# EAGLE design kicker (EAGLE 6.1)
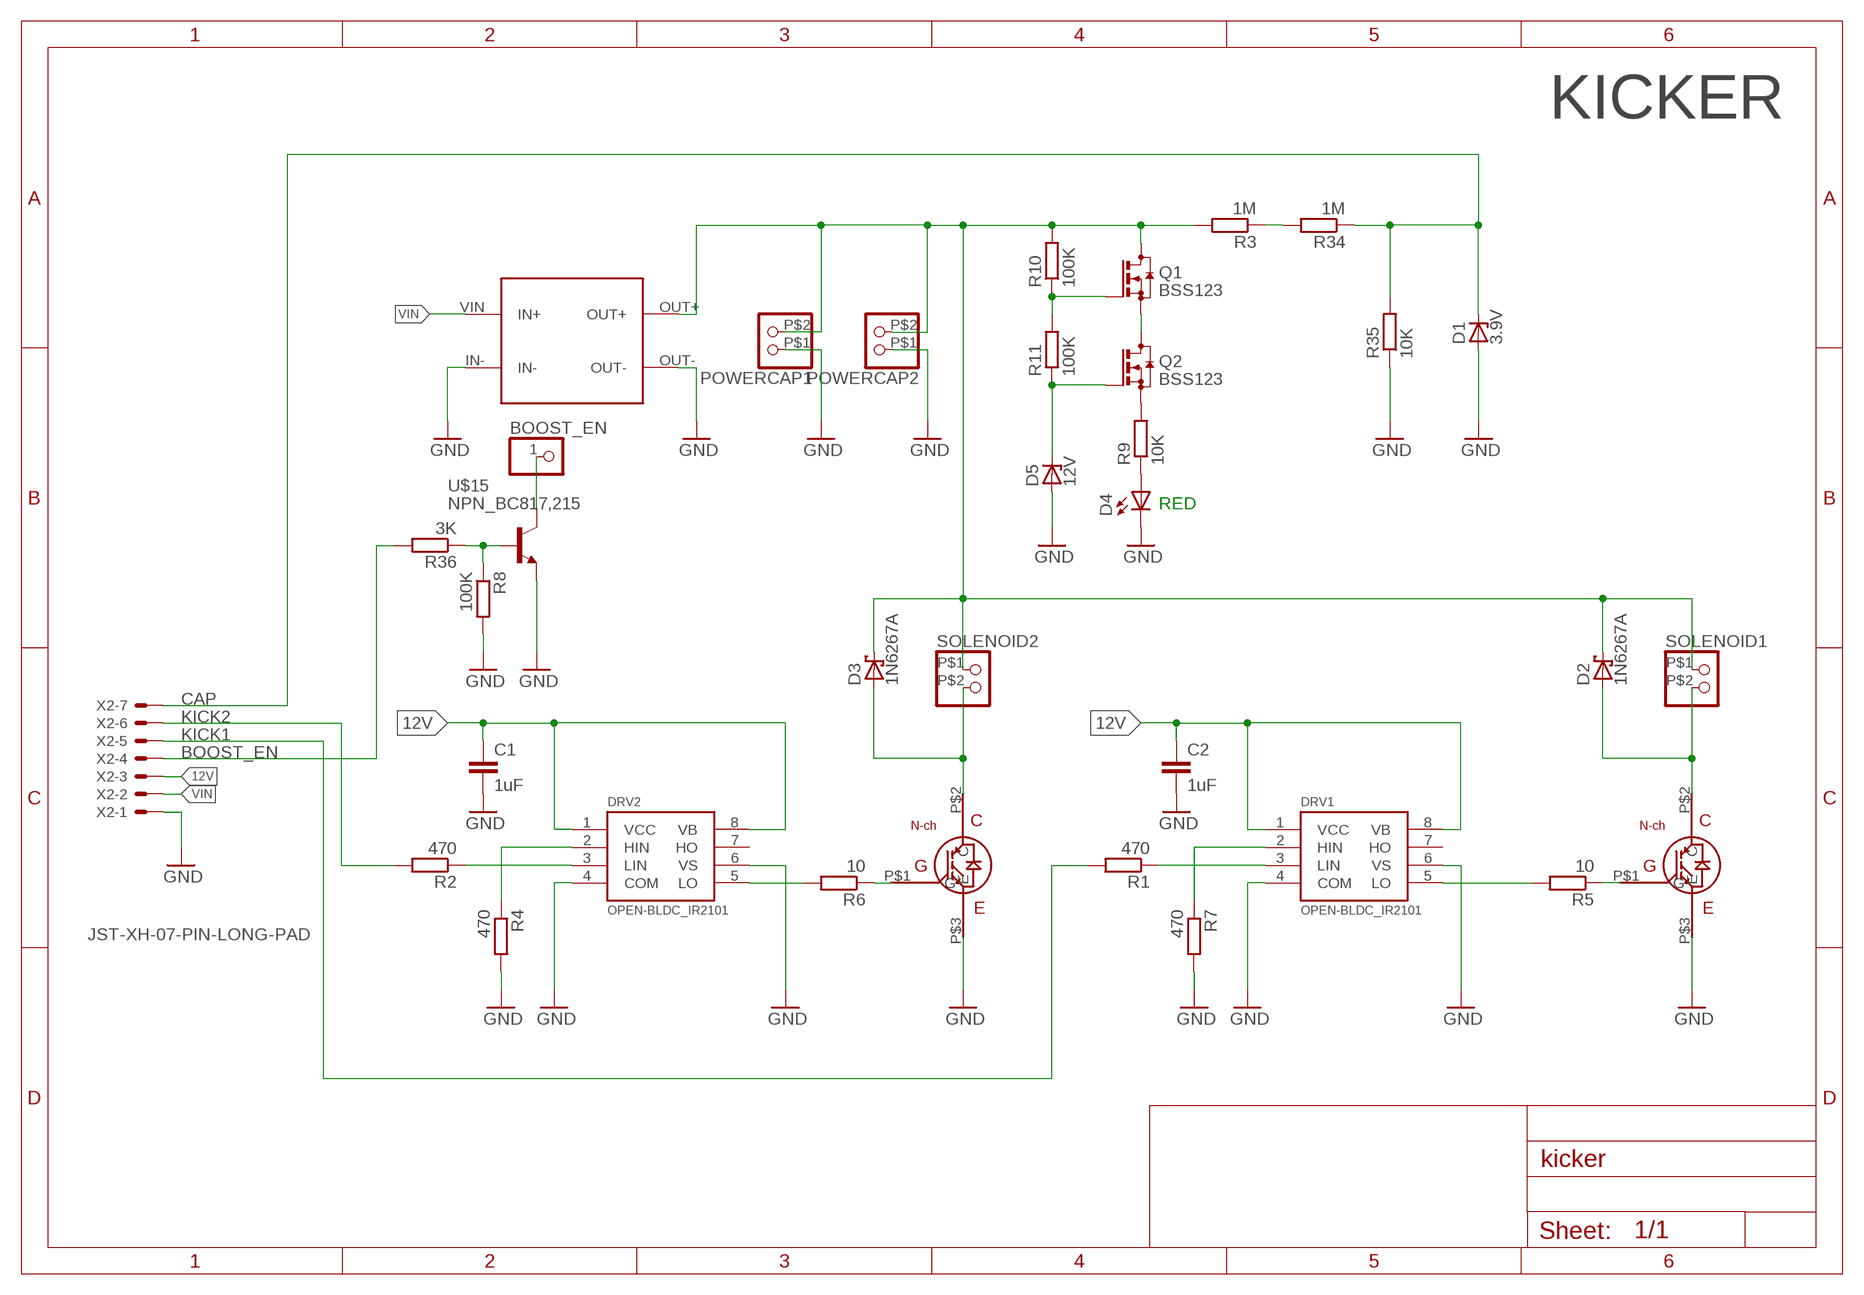
[diagram p0: schematic, sheet 1]

## Parts
BOOST_EN  CONNEC_1X01  [CONNEC_1X01]
C1  1uF  C-EUC0805  [C0805]
C2  1uF  C-EUC0805  [C0805]
D1  3.9V  ZENER-DIODESOD80C  [SOD80C]
D2  1N6267A  [C4111-15]
D3  1N6267A  [C4111-15]
D4  RED  LED1206  [LED-1206]
D5  12V  ZENER-DIODESOD80C  [SOD80C]
DRV1  OPEN-BLDC_IR2101  [OPEN-BLDC_SO-8]
DRV2  OPEN-BLDC_IR2101  [OPEN-BLDC_SO-8]
POWERCAP1  CONNEC_1X02BIG  [CONNEC_1X02_BIG]
POWERCAP2  CONNEC_1X02BIG  [CONNEC_1X02_BIG]
Q1  BSS123  [SOT23]
Q2  BSS123  [SOT23]
R1  470  RESISTANCE-R0805  [R0805]
R2  470  RESISTANCE-R0805  [R0805]
R3  1M  RESISTANCE-R0805  [R0805]
R4  470  RESISTANCE-R0805  [R0805]
R5  10  RESISTANCE-R0805  [R0805]
R6  10  RESISTANCE-R0805  [R0805]
R7  470  RESISTANCE-R0805  [R0805]
R8  100K  RESISTANCE-R0805  [R0805]
R9  10K  RESISTANCE-R0805  [R0805]
R10  100K  RESISTANCE-R0805  [R0805]
R11  100K  RESISTANCE-R0805  [R0805]
R34  1M  RESISTANCE-R0805  [R0805]
R35  10K  RESISTANCE-R0805  [R0805]
R36  3K  RESISTANCE-R0805  [R0805]
SOLENOID1  CONNEC_1X02BIG  [CONNEC_1X02_BIG]
SOLENOID2  CONNEC_1X02BIG  [CONNEC_1X02_BIG]
U$1  TO-247A  [TO-247]
U$5  BOOSTER  [BOOSTER_390V]
U$11  TO-247A  [TO-247]
U$15  NPN_BC817,215  [SOT-23]
X2  JST-XH-07-PIN-LONG-PAD  [JST-XH-07-PACKAGE-LONG-PAD]

## Nets
12V: C1.1 C2.1 DRV1.1(VCC) DRV1.8(VB) DRV2.1(VCC) DRV2.8(VB) X2.3
BOOST_EN: R36.2 X2.4
CAP: D1.C R34.1 R35.2 X2.7
GND [alim_big]: C1.2 C2.2 D1.A D4.C D5.A DRV1.4(COM) DRV1.6(VS) DRV2.4(COM) DRV2.6(VS) POWERCAP1.P$1 POWERCAP2.P$1 R4.2 R7.2 R8.2 R35.1 U$1.P$3(E) U$5.IN- U$5.OUT- U$11.P$3(E) U$15.2(E) X2.1
KICK1: R1.2 X2.5
KICK2: R2.2 X2.6
N$1: DRV2.3(LIN) R2.1
N$2 [alim_big]: D2.A SOLENOID1.P$2 U$1.P$2(C)
N$3: DRV2.5(LO) R6.2
N$4: R3.1 R34.2
N$5: DRV1.3(LIN) R1.1
N$6: DRV2.2(HIN) R4.1
N$7: R5.1 U$1.P$1(G)
N$8: R6.1 U$11.P$1(G)
N$9: DRV1.5(LO) R5.2
N$10: Q2.2(S) R9.2
N$11: D4.A R9.1
N$12: Q1.2(S) Q2.3(D)
N$13: DRV1.2(HIN) R7.1
N$14: Q1.1(G) R10.1 R11.2
N$16 [alim_big]: D5.C Q2.1(G) R11.1
N$36 [alim_big]: D3.A SOLENOID2.P$2 U$11.P$2(C)
N$37: BOOST_EN.1 U$15.3(C)
N$38: R8.1 R36.1 U$15.1(B)
VBOOST: D2.C D3.C POWERCAP1.P$2 POWERCAP2.P$2 Q1.3(D) R3.2 R10.2 SOLENOID1.P$1 SOLENOID2.P$1 U$5.OUT+
VIN [alim_big]: U$5.VIN(IN+) X2.2
Unconnected: DRV1.7(HO) DRV2.7(HO)

## Notes on the sheet
- KICKER
- RED

## Library data of the parts
BOOST_EN = rhoban:CONNEC_1X01; FARNELL: -
C1 C2 = rcl:C-EU: CAPACITOR, European symbol
D1 = diode:ZENER-DIODE: Z-Diode; FARNELL: 1097198
D2 D3 = diode:1N6267A: DIODE transient voltage suppressor; FARNELL: 9551735
D4 = SparkFun:LED: LEDs Standard schematic elements and footprints for 5mm, 3mm, 1206, and 0603 sized LEDs. 5mm - Spark Fun Electronics SKU : COM-00529 (and others); FARNELL: 1581233
D5 = diode:ZENER-DIODE: Z-Diode; FARNELL: 2319144
DRV1 DRV2 = rhoban:OPEN-BLDC_IR2101; FARNELL: 8638730
POWERCAP1 POWERCAP2 SOLENOID1 SOLENOID2 = rhoban:CONNEC_1X02; FARNELL: -
Q1 Q2 = transistor-small-signal:BSS123: N-CHANNEL MOS FET
R1 R2 R4-R8 R36 = rhoban:RESISTANCE: RESISTOR, European symbol; FARNELL: 2446965
R3 R34 = rhoban:RESISTANCE: RESISTOR, European symbol; FARNELL: 2129375
R9-R11 R35 = rhoban:RESISTANCE: RESISTOR, European symbol; FARNELL: 2447553
U$1 U$11 = to-247_n-channel_igbt:TO-247; FARNELL: 2429705
U$5 = rhoban:BOOSTER; FARNELL: -
U$15 = rhoban:NPN; FARNELL: 1081223
X2 = Rembrandt Electronics - JST XH Connectors v1-0:JST-XH-07-PIN: JST XH Connector 2 Pin Wire to board connector. Pitch: 2,54 mm, (0.100") Number of pins: 7 Created by Rembrandt Electronics www.rembrandtelectronics.com

## Net classes
0 default: width 0.381 mm
1 alim_small: width 0.381 mm
2 alim_big: width 0.381 mm

## Board
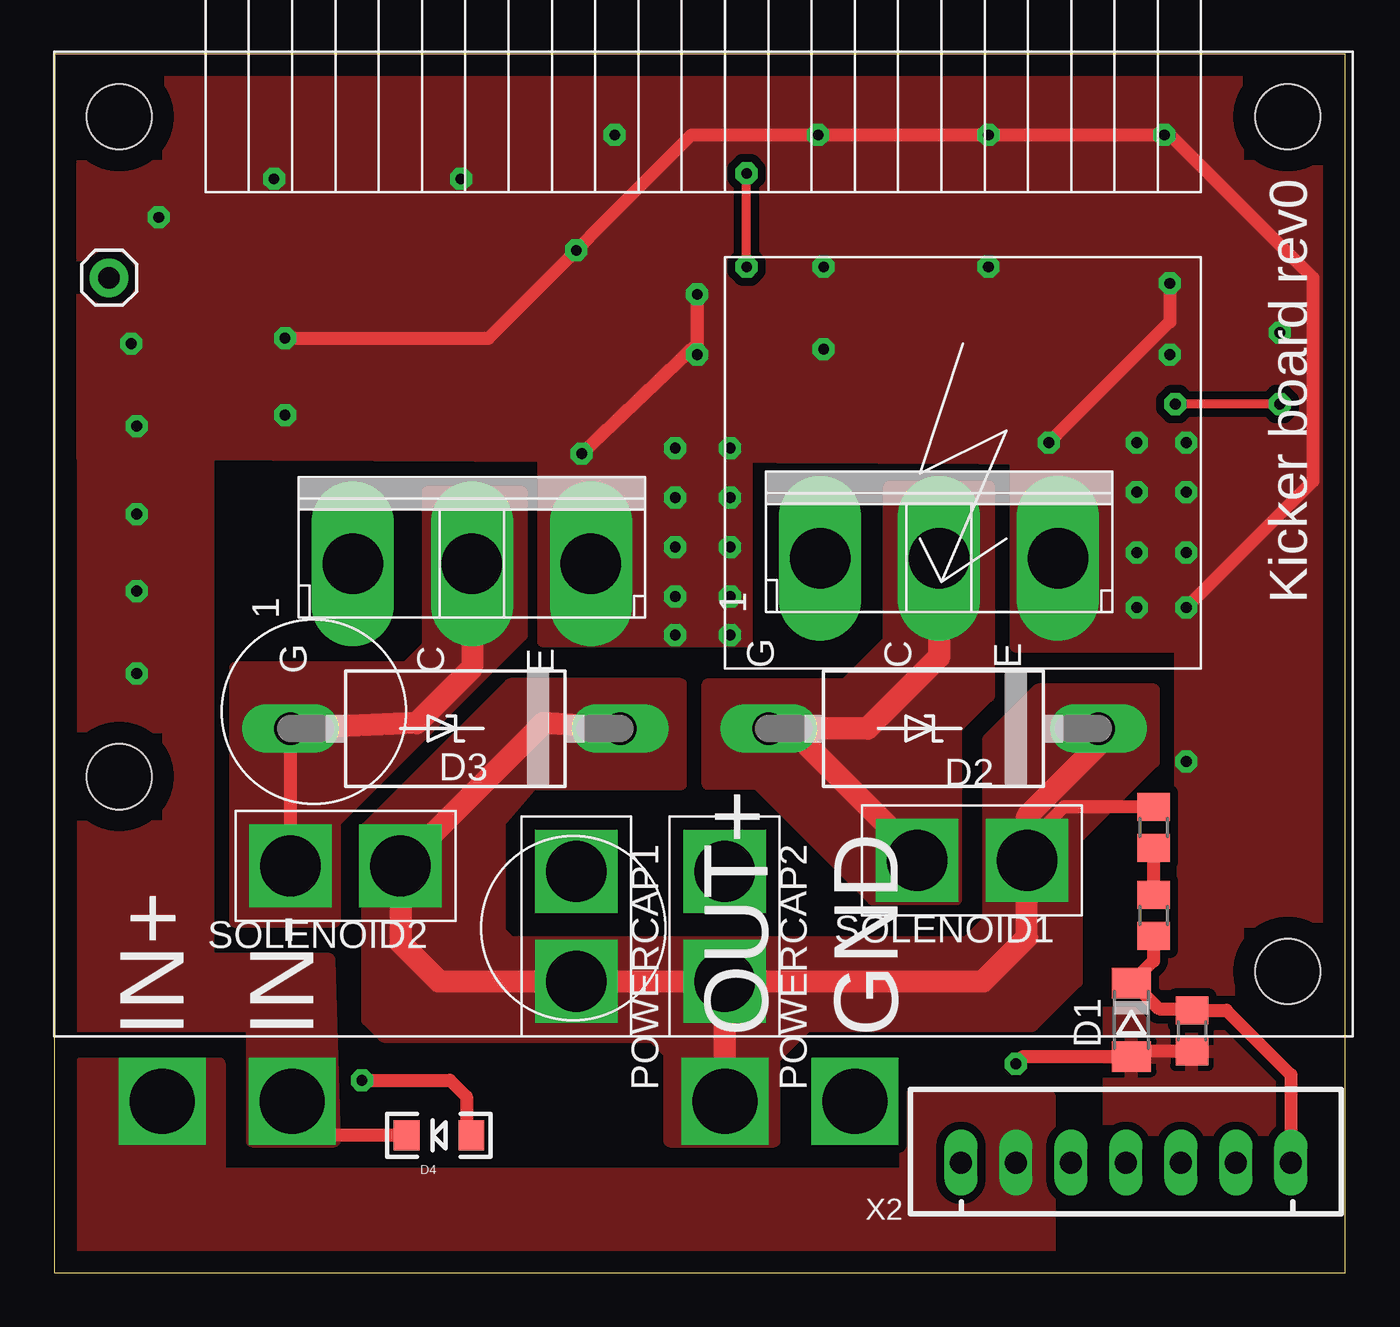
[diagram p1: board, top side]
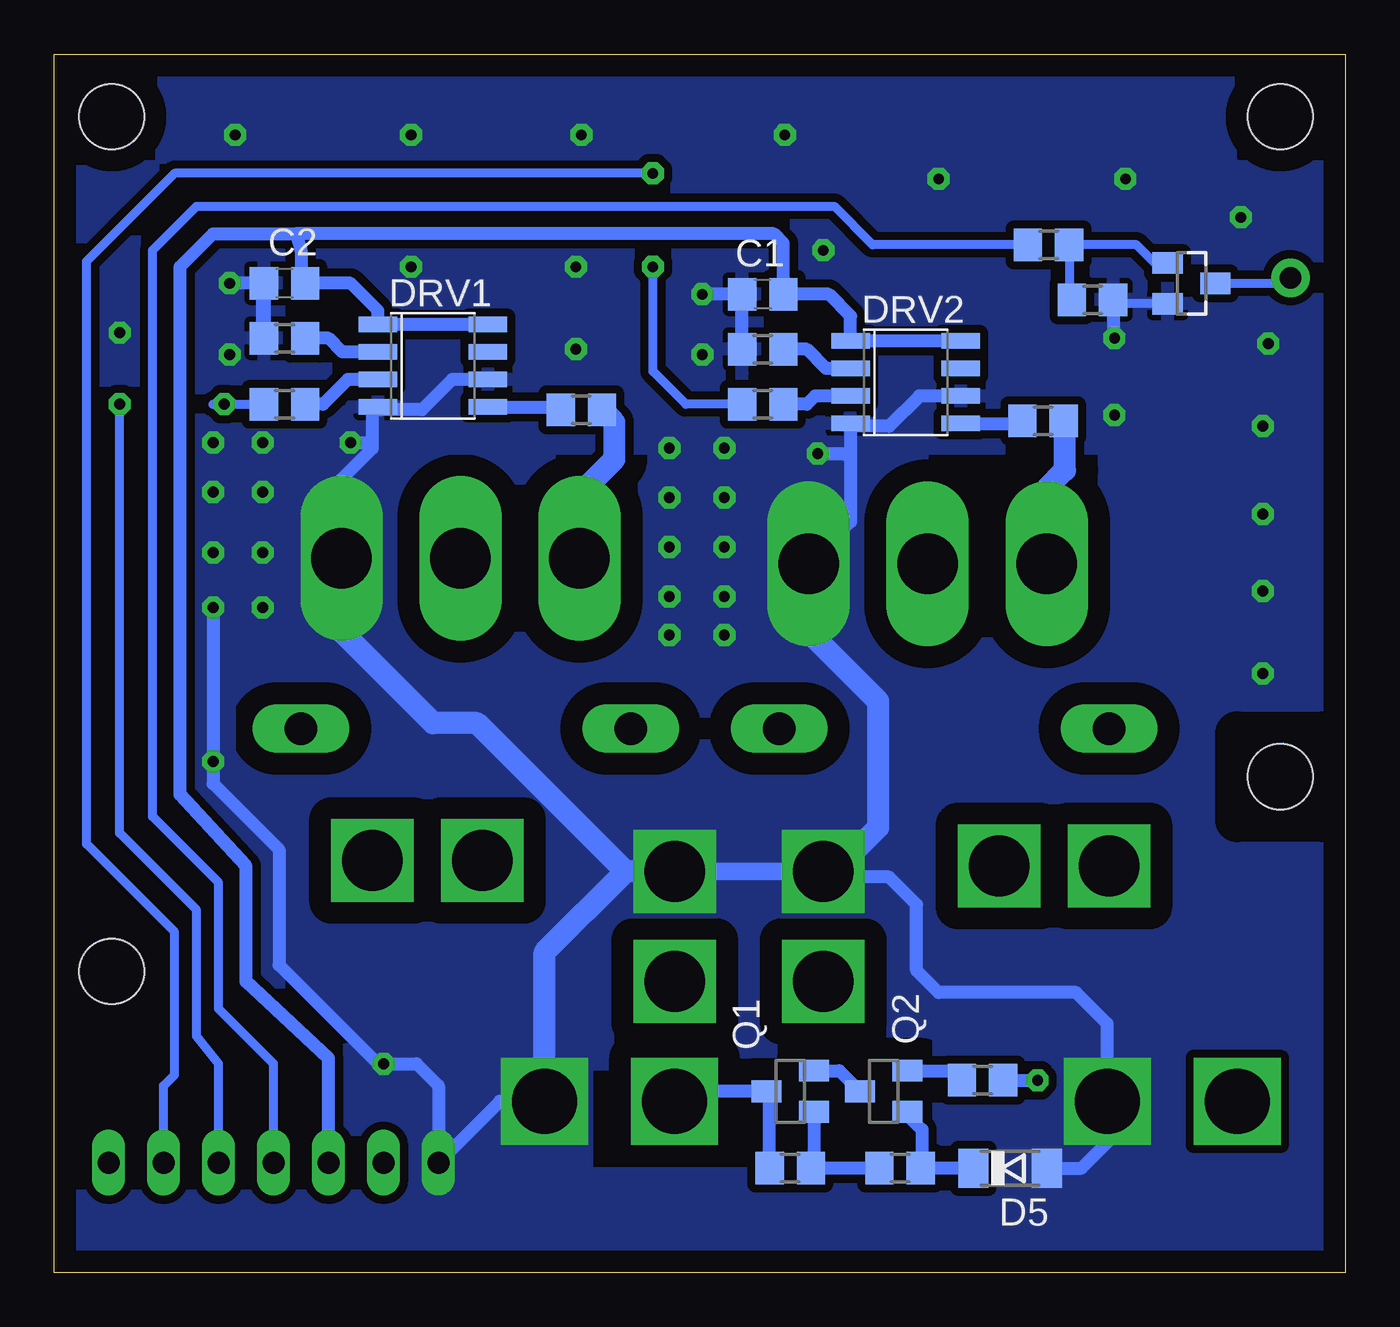
[diagram p2: board, bottom side, seen from below]

Size 59.67 x 56.31 mm. Coordinates in mm from the lower left corner, seen from the top.
Outline: 0,0 59.67,0 59.67,56.31 0,56.31 0,0
Copper layers (1*16): Top 0.035mm / dielectric 1.5mm / Bottom 0.035mm
Design rules: minimum track width 10mil, minimum drill 0.5mm, track to track 15mil, track to pad 20mil, pad to pad 8mil, via to via 8mil, smd to smd 8mil, copper to edge 40mil, drill to drill 8mil, minimum pad ring 10mil, minimum via ring 8mil, stop-mask expansion 0mil, vias tented up to drill 0mil, thermal gap 10mil

### Footprints (pad centres in the part's own frame; a part is rotated, then mirrored left to right if it is on the bottom)
CONNEC_1X01 = drill 1 pad 1.778: 1 0,0
C0805 = smd 1.3 x 1.5: 1 -0.95,0; 2 0.95,0
SOD80C = smd 1.4 x 1.8: A 1.7,0; C -1.7,0
C4111-15 = drill 1.499 long: A 7.62,0; C -7.62,0
LED-1206 = smd 1.2 x 1.4: A -1.5,0; C 1.5,0
OPEN-BLDC_SO-8 = smd 0.72 x 1.78: 1 -1.905,-2.543; 2 -0.635,-2.543; 3 0.635,-2.543; 4 1.905,-2.543; 5 1.905,2.543; 6 0.635,2.543; 7 -0.635,2.543; 8 -1.905,2.543
CONNEC_1X02_BIG = drill 2.8 square: P$1 0,0; P$2 5.08,0
SOT23 = smd 1 x 1.4: 1 -0.95,-1.1; 2 0.95,-1.1; 3 0,1.1
R0805 = smd 1.3 x 1.5: 1 -0.95,0; 2 0.95,0
TO-247 = drill 2.8 pad 3.81 long: P$1 0,5.5; P$2 0,0; P$3 0,-5.5
BOOSTER_390V = drill 3 square: IN- 11,-3; OUT+ 31,-3; OUT- 37,-3; VIN 5,-3 | hole 3: 57,3; 57,42.5; 3,42.5; 3,12
SOT-23 = smd 1 x 1.4: 1 -0.95,-1.1; 2 0.95,-1.1; 3 0,1.1
JST-XH-07-PACKAGE-LONG-PAD = drill 1.016 long: 1 -7.62,0; 2 -5.08,0; 3 -2.54,0; 4 0,0; 5 2.54,0; 6 5.08,0; 7 7.62,0

### Placement (x,y rotation side)
BOOST_EN  2.54,45.97 90 top
C1  26.92,45.21 180 bottom
C2  49.02,45.72 180 bottom
D1  49.78,11.68 270 top
D2  40.64,25.15 180 top
D3  18.54,25.15 180 top
D4  17.78,6.35 180 top
D5  15.49,4.83 0 bottom
DRV1  42.16,41.91 270 bottom
DRV2  20.32,41.15 270 bottom
POWERCAP1  24.13,18.54 270 top
POWERCAP2  30.99,18.54 270 top
Q1  25.65,8.38 90 bottom
Q2  21.34,8.38 90 bottom
R1  49.02,40.13 180 bottom
R2  26.92,40.13 180 bottom
R3  50.8,20.57 90 top
R4  26.92,42.67 180 bottom
R5  35.31,39.88 180 bottom
R6  13.97,39.37 180 bottom
R7  49.02,43.18 180 bottom
R8  11.68,44.96 0 bottom
R9  16.76,8.89 180 bottom
R10  25.65,4.83 180 bottom
R11  20.57,4.83 180 bottom
R34  50.8,16.51 90 top
R35  52.58,11.18 90 top
R36  13.72,47.5 180 bottom
SOLENOID1  44.96,19.05 180 top
SOLENOID2  16,18.8 180 top
U$1  40.89,33.02 90 top
U$5  0,10.92 0 top
U$11  19.3,32.77 90 top
U$15  7.11,45.72 270 bottom
X2  49.53,5.08 0 top

### Tracks (layer width: path | path; a pad name or v marks a point on that pad's centre or on a via)
12V
  Bottom 0.61: DRV2.8 DRV2.1 22.86,44.2 23.88,45.21 C1.1 25.97,47.56 26.42,48.01 48.51,48.01 | DRV1.8 DRV1.1 44.71,44.45 45.97,45.72 C2.1 48.26,45.91 48.26,47.24 48.51,48.01 | X2.3 46.99,9.91 50.8,13.46 50.8,18.8 53.85,22.1 53.85,46.48 52.32,48.01 48.51,48.01
BOOST_EN
  Bottom 0.406: X2.4 49.53,9.65 52.07,12.19 52.07,18.03 55.12,21.08 55.12,47.24 53.09,49.28 23.62,49.28 21.84,47.5 R36.2
CAP
  Top 0.61: R34.1 50.8,14.4 D1.C 49.86,13.38 51.05,12.19 52.51,12.19 R35.2 54.17,12.13 57.15,9.14 X2.7
GND  (via drill 0.5 pad 1.02)
  Top 0.61: v51.56,45.72 51.56,43.94 v45.97,38.35 | v29.72,45.21 29.72,42.93 v24.38,37.85 | v10.67,43.18 20.07,43.18 29.46,52.58 51.56,52.58 58.17,45.97 58.17,36.58 v52.32,30.73 | 11.46,8.38 U$5.IN- | D4.C 12.45,6.35 10.92,7.87 | R35.1 50.03,10.23 D1.A 44.78,9.98 v44.45,9.65
  Bottom 0.406: U$15.2 10.55,44.77 R8.2
  Bottom 0.61: 22.86,37.59 DRV2.4 22.74,39.12 21.08,39.12 19.68,40.51 DRV2.6 | 22.86,37.59 22.86,34.71 U$11.P$3 | U$1.P$3 46.39,36.66 44.96,38.1 44.96,38.35 | 44.96,38.35 44.96,39.75 DRV1.4 44.58,39.88 42.67,39.88 41.27,41.27 DRV1.6 | C2.2 49.97,43.5 50.29,43.18 50.04,42.93 50.04,45.47 50.29,45.72 v51.56,45.72 | v45.97,38.35 44.96,38.35 | C1.2 R4.2 27.87,45.15 27.94,45.21 v29.72,45.21 | v24.38,37.85 23.12,37.85 22.86,37.59 | R8.2 10.73,43.25 v10.67,43.18 | 24.13,18.03 23.88,18.29 21.08,18.29 19.81,17.02 19.81,13.97 18.8,12.95 12.45,12.95 11,11.51 U$5.IN- 10.92,7.84 10.92,6.1 12.19,4.83 D5.A | U$5.OUT- 39.07,7.92 X2.1 41.91,8.64 42.93,9.65 v44.45,9.65 44.45,9.4 49.28,14.22 49.28,19.56 52.32,22.61 v52.32,30.73
  Bottom 0.813: POWERCAP1.P$1 POWERCAP2.P$1 31.5,19.05
  Bottom 1.016: U$11.P$3 24.8,29.63 21.59,26.42 21.59,20.57 24.13,18.03 24.13,18.29 23.88,18.54 | POWERCAP2.P$1 33.27,18.54 | 33.27,18.54 40.13,25.4 42.16,25.4 46.48,29.72 46.48,32.93 U$1.P$3 | U$5.OUT- 37,14.82 33.27,18.54
  other vias: 10.67,39.62 3.81,27.69 3.81,31.5 3.81,35.05 3.81,39.12 3.56,42.93 28.7,35.81 28.7,33.53 28.7,31.24 28.7,29.46 31.24,29.46 31.24,31.24 31.24,33.53 31.24,35.81 50.04,30.73 50.04,33.27 50.04,36.07 52.32,36.07 52.32,33.27 52.32,38.35 50.04,38.35 28.7,38.1 31.24,38.1 35.56,42.67 35.56,46.48 43.18,46.48 35.31,52.58 43.18,52.58 51.31,52.58 4.83,48.77 10.16,50.55 18.8,50.55 25.91,52.58 24.13,47.24 29.72,42.42 51.56,42.42 56.64,43.43 52.32,23.62
  pour Bottom (no thermals): 0.25,14.73 18.8,14.73 18.8,4.57 35.05,4.57 35.05,10.41 59.69,10.16 59.69,0 59.44,0.25 0,0.25 0.25,0.51
  pour Bottom (isolate 1.016, no thermals): 1.02,38.35 51.56,38.35 51.82,9.65 1.27,9.65
  pour Bottom: 0.25,56.39 59.18,56.39 59.18,2.03 49.28,2.03 49.28,22.35 51.56,22.35 51.56,38.1 0.25,38.1
  pour Top: 0.76,55.63 59.18,55.63 59.18,0.76 48.77,0.76 48.77,18.54 52.07,21.59 52.07,37.59 0.76,37.85
  pour Top (no thermals): 12.95,6.1 12.7,14.48 7.11,14.48 7.11,38.1 1.02,38.1 1.02,11.43 9.14,11.43 9.14,6.1
  pour Top (no thermals): 22.61,37.59 22.61,29.21 32,29.21 32,37.85 22.86,37.85
  pour Top (no thermals): 44.45,37.34 44.45,28.96 53.85,28.96 53.85,37.59 44.7,37.59
KICK1  (via drill 0.5 pad 1.02)
  Top 0.406: v56.64,40.13 v51.82,40.13
  Bottom 0.406: X2.5 52.07,9.65 53.09,10.92 53.09,16.76 56.64,20.32 v56.64,40.13 | 52.32,40.13 v51.82,40.13 50.04,40.13 | 50.04,40.13 49.78,40.39 | R1.2 50.04,40.13
KICK2  (via drill 0.5 pad 1.02)
  Top 0.406: v32,46.48 v32,50.8
  Bottom 0.406: X2.6 54.61,8.64 54.1,9.14 54.1,15.75 58.17,19.81 58.17,46.74 54.1,50.8 v32,50.8 | R2.2 30.48,40.13 32,41.66 v32,46.48
N$1
  Bottom 0.61: DRV2.3 24.51,40.51 24.89,40.13 R2.1
N$2
  Top 1.016: U$1.P$2 40.89,28.45 37.59,25.15 34.04,25.15 | 34.04,25.15 33.27,25.15 33.02,24.89 | SOLENOID1.P$2 39.88,19.3 34.04,25.15
  pour Top (no thermals): 38.61,36.32 43.18,36.32 43.18,26.67 41.66,25.15 41.66,17.27 37.85,17.27 32.51,22.61 30.23,22.61 30.23,27.18 36.58,27.18 38.61,29.21
N$3
  Bottom 0.61: DRV2.5 14.99,39.24 | 14.99,39.24 14.86,39.24 | 14.86,39.24 14.73,39.37 | 14.86,39.24 14.99,39.12 | R6.2 14.99,39.37 14.99,39.24
  Bottom 1.016: 15.05,39.24 R6.2
N$4
  Top 0.61: R3.1 R34.2
N$5
  Bottom 0.61: DRV1.3 46.1,41.27 47.24,40.13 R1.1
N$6
  Bottom 0.61: DRV2.2 24,41.78 24.89,42.67 R4.1
N$7
  Bottom 1.016: U$1.P$1 35.39,35.98 33.78,37.59 33.78,39.3 R5.1
N$8
  Bottom 1.016: U$11.P$1 13.8,36.23 12.95,37.08 12.95,39.3 R6.1
N$9
  Bottom 0.61: DRV1.5 36.26,40.01 R5.2
  Bottom 1.016: 36.38,40.01 R5.2
N$10
  Bottom 0.61: Q2.2 18.16,9.33 R9.2
N$11  (via drill 0.5 pad 1.02)
  Top 0.61: v14.22,8.89 18.29,8.89 19.05,8.13 19.05,6.58 D4.A
  Bottom 0.61: R9.1 v14.22,8.89
N$12
  Bottom 0.61: Q1.2 23.39,9.33 Q2.3
N$13
  Bottom 0.61: DRV1.2 46.35,42.55 46.99,43.18 R7.1
N$14
  Bottom 0.61: R11.2 24.13,4.83 | 24.13,4.83 R10.1 | Q1.1 24.55,5.25 24.13,4.83
N$16
  Bottom 0.61: D5.C R11.1 19.56,4.89 19.56,6.6 20.24,7.28 Q2.1
N$36
  Top 0.61: SOLENOID2.P$2 10.92,24.64
  Top 1.016: 19.3,29.72 19.3,27.94 16.76,25.4 D3.A 10.16,25.4
  pour Top (no thermals): 8.38,16.26 12.95,16.26 12.95,20.83 21.59,29.46 21.59,36.07 17.27,36.07 17.27,28.96 16.26,27.94 8.38,27.94
N$37
  Bottom 0.406: U$15.3 2.79,45.72 BOOST_EN.1
N$38
  Bottom 0.406: U$15.1 8.82,46.67 9.65,47.5 R36.1 12.77,45.09 R8.1
VBOOST
  Top 0.61: 45.65,19.75 44.7,18.8 44.96,18.8 | R3.2 46.67,21.52 44.7,19.56 44.7,19.3 45.21,18.8
  Top 1.016: POWERCAP2.P$2 POWERCAP1.P$2 17.78,13.46 16,15.24 SOLENOID2.P$1 22.61,25.4 D3.C | POWERCAP2.P$2 42.93,13.46 44.96,15.49 44.96,18.8 SOLENOID1.P$1 44.96,21.08 49.02,25.15 | U$5.OUT+ 31,13.45 POWERCAP2.P$2
  Bottom 0.61: R10.2 26.6,8.23 Q1.3 29.46,8.38 30.23,7.62 30.53,7.92 U$5.OUT+
  pour Top (no thermals): 28.96,27.18 21.08,27.18 14.48,20.57 14.48,11.68 15.24,10.92 27.69,10.92 28.45,10.16 28.45,6.1 33.27,6.1 33.27,9.91 34.8,11.43 45.21,11.43 47.24,13.46 47.24,20.07 50.8,23.62 50.8,26.92 45.47,26.92 43.18,24.64 43.18,16.26 42.16,15.24 21.08,15.24 20.57,15.75 20.57,20.83 22.1,22.61 28.96,22.61
VIN
  pour Top (no thermals): 1.27,9.65 7.62,9.65 7.62,4.57 39.37,4.57 39.37,8.13 45.97,8.13 45.97,0.51 1.27,0.25

### Text on the board
tNames: Kicker board rev0